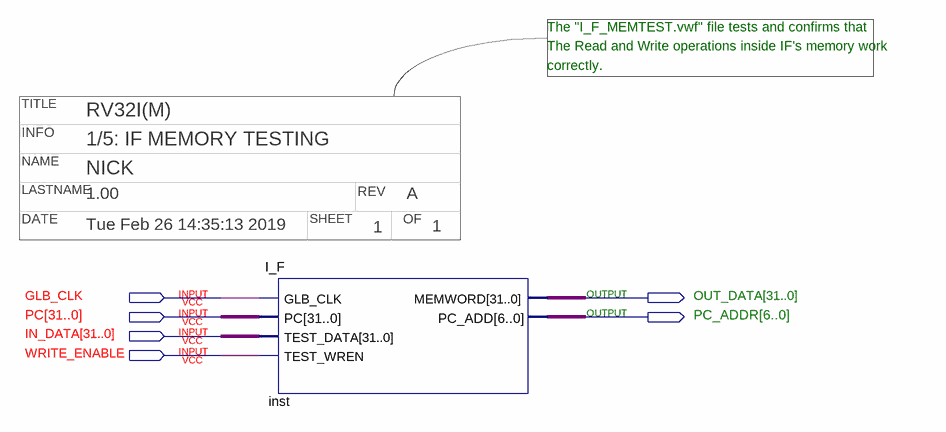
[diagram p0: schematic sheet]
// Quartus schematic I_F_MEMTEST.bdf as structural Verilog: 1 symbols, 6 pins
// Title block: TITLE: RV32I(M); INFO: 1/5: IF MEMORY TESTING; NAME: NICK; LASTNAME: 1.00; REV: A; DATE: Tue Feb 26 14:35:13 2019; SHEET: 1; OF: 1
module I_F_MEMTEST (
  input  GLB_CLK,
  input  [31:0] PC,
  input  [31:0] IN_DATA,
  input  WRITE_ENABLE,
  output [31:0] OUT_DATA,
  output [6:0] PC_ADDR
);

  I_F inst (
    .GLB_CLK(GLB_CLK), .PC(PC), .TEST_DATA(IN_DATA), .TEST_WREN(WRITE_ENABLE), .MEMWORD(OUT_DATA),
    .PC_ADD(PC_ADDR));

  // Notes on the sheet:
  //   The "I_F_MEMTEST.vwf" file tests and confirms that
  //   The Read and Write operations inside IF's memory work
  //   correctly.
endmodule
